# EAGLE design Crossover_LP (EAGLE 7.5.0)
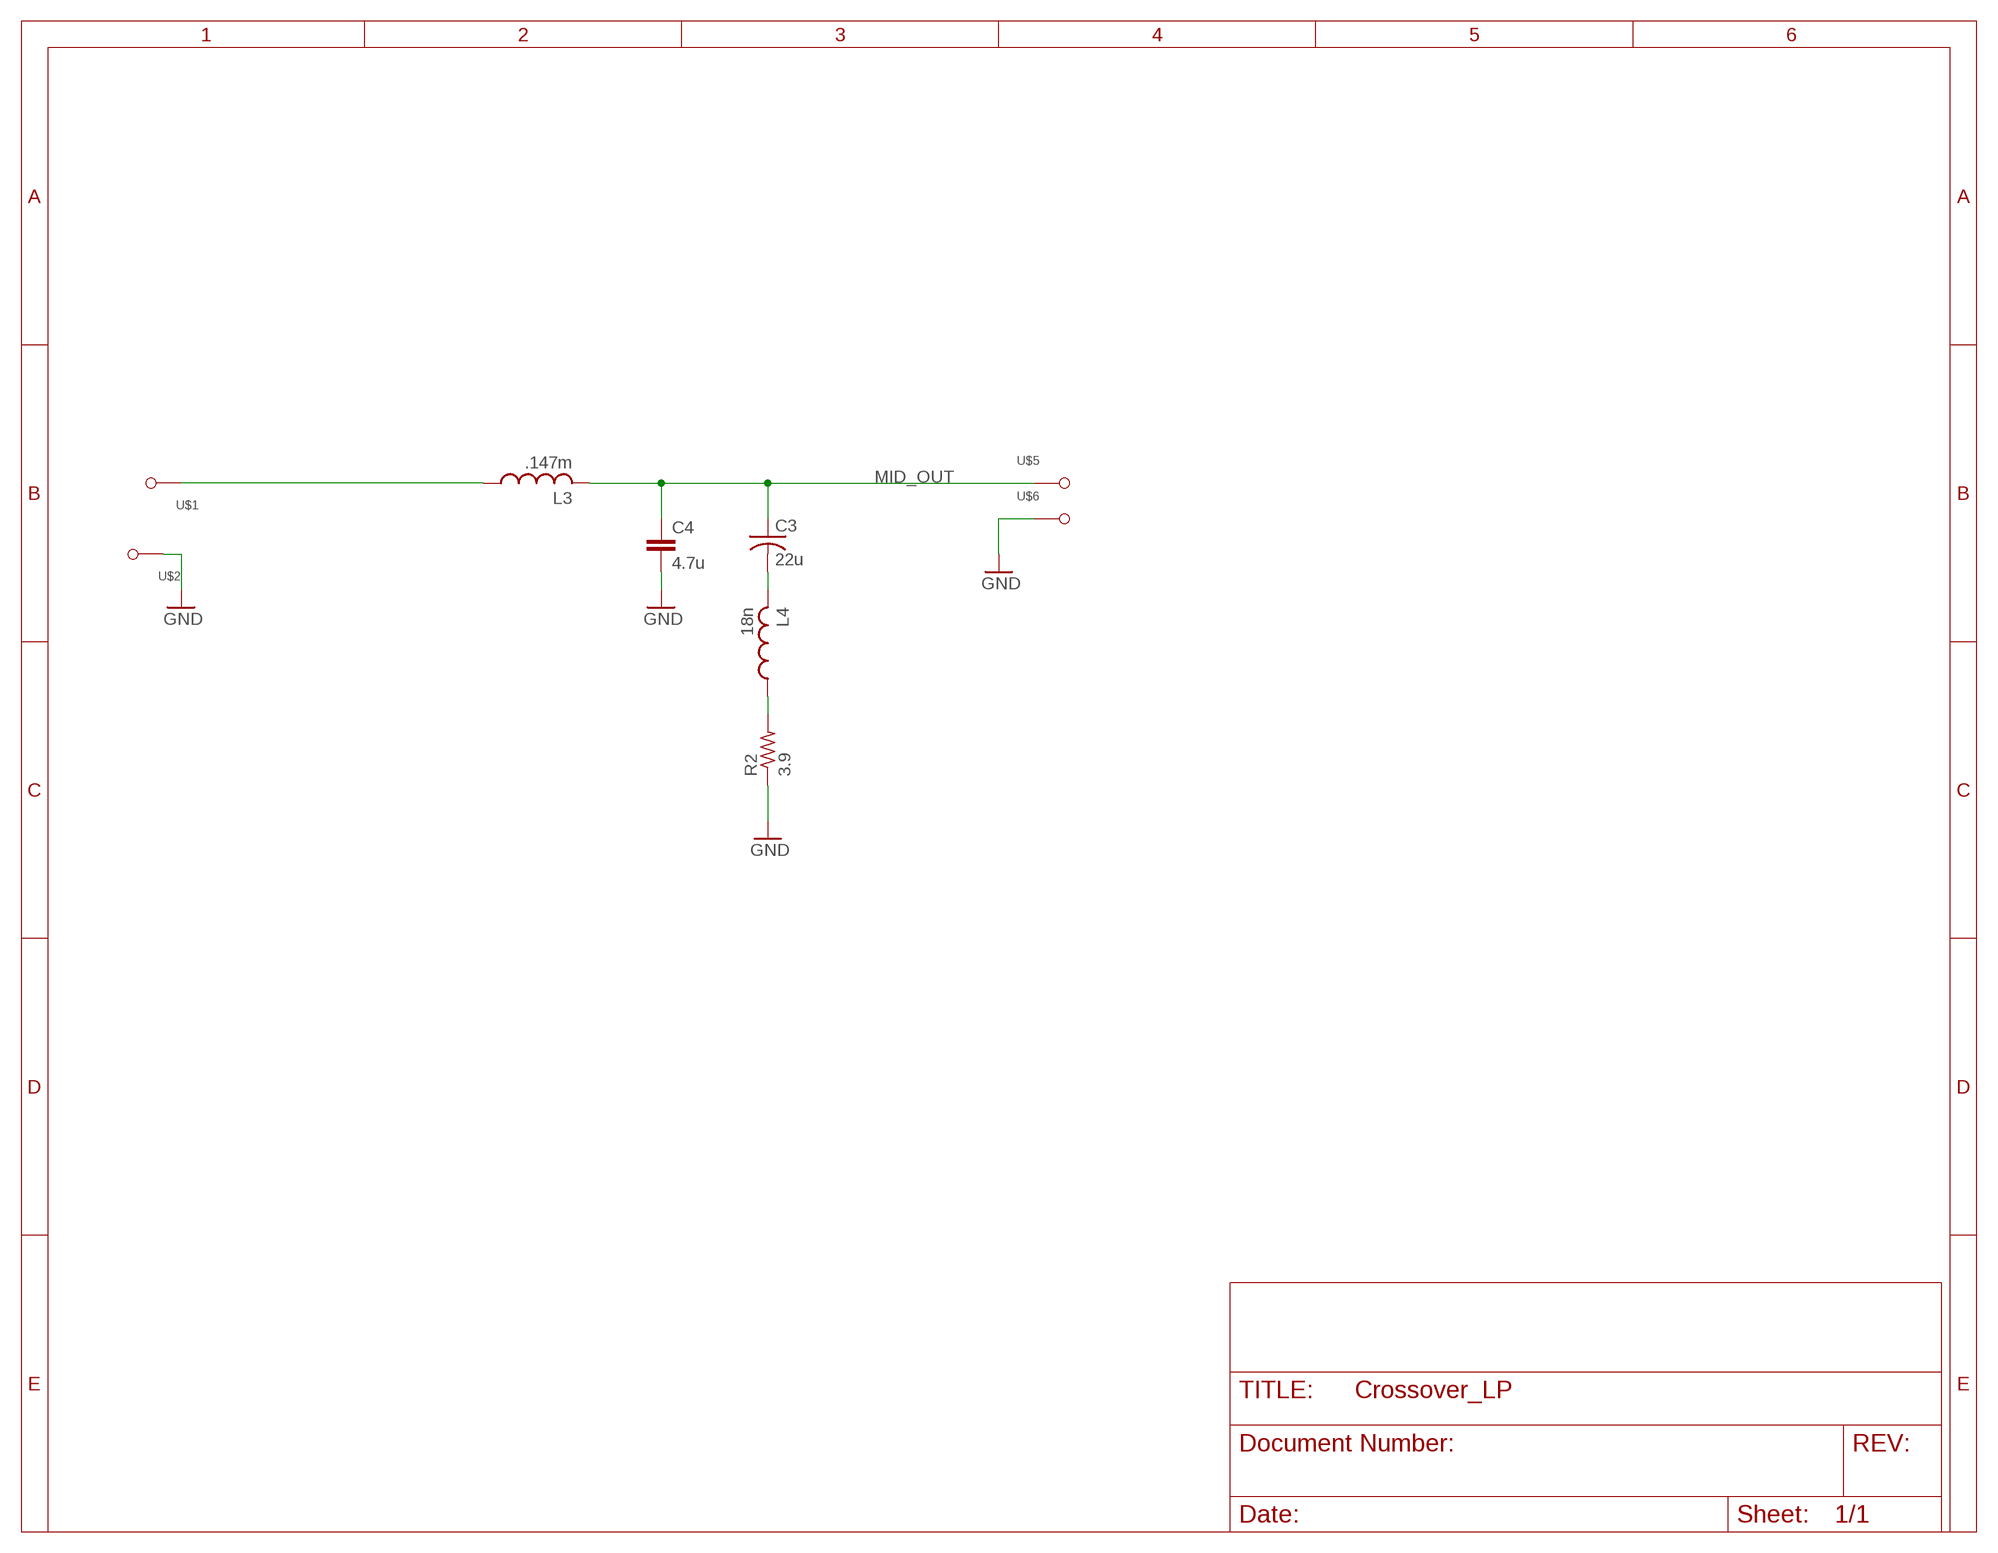
[diagram p0: schematic, sheet 1]

## Parts
C3  22u  C-USC5MMP_10MMD  [5MMP_10MMD]
C4  4.7u  C-EU225-074X268  [C225-074X268]
L3  .147m  L-US  [AIR_COIL_2INX3/4IN]
L4  18n  L-US  [AIR_COIL_2INX3/4IN]
R2  3.9  R-US_5W  [9.5MMX9MMX22MM]
U$1  18AWG_HOLE  [18AWG_HOLE]
U$2  18AWG_HOLE  [18AWG_HOLE]
U$5  18AWG_HOLE  [18AWG_HOLE]
U$6  18AWG_HOLE  [18AWG_HOLE]

## Nets
GND: C4.2 R2.P$1 U$2.P$1(>NAME) U$6.P$1(>NAME)
MID_OUT: C3.POS C4.1 L3.P$2 U$5.P$1(>NAME)
N$6: L3.P$1 U$1.P$1(>NAME)
N$8: C3.NEG L4.P$2
N$9: L4.P$1 R2.P$2

## Library data of the parts
C3 = rcl:C-US: CAPACITOR, American symbol
C4 = rcl:C-EU: CAPACITOR, European symbol
L3 L4 = rcl:L-US: INDUCTOR, American symbol
R2 = rcl:R-US_: RESISTOR, American symbol
U$1 U$2 U$5 U$6 = Amplifier_Parts:18AWG_HOLE

## Board
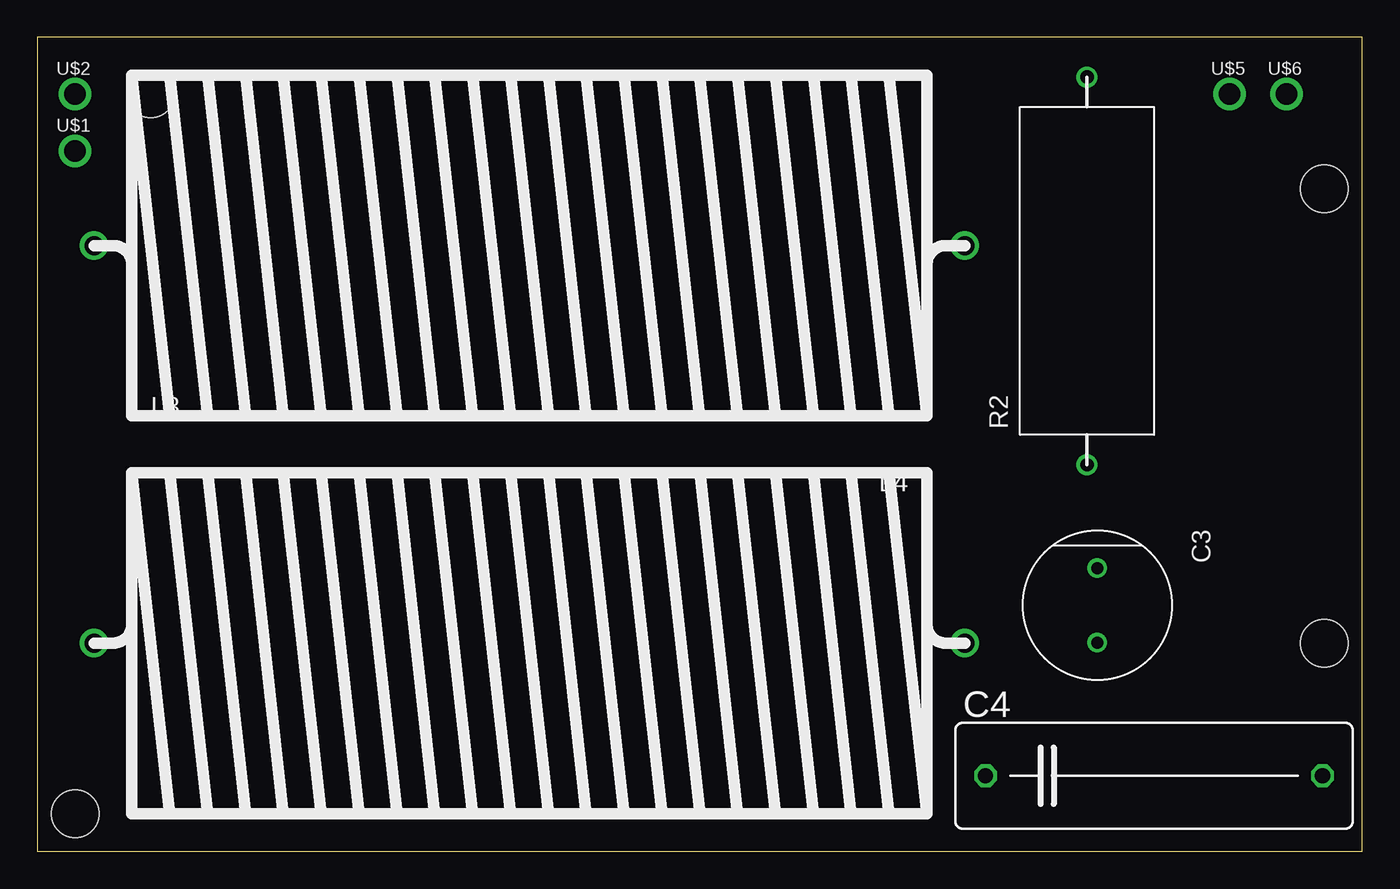
[diagram p1: board, top side]
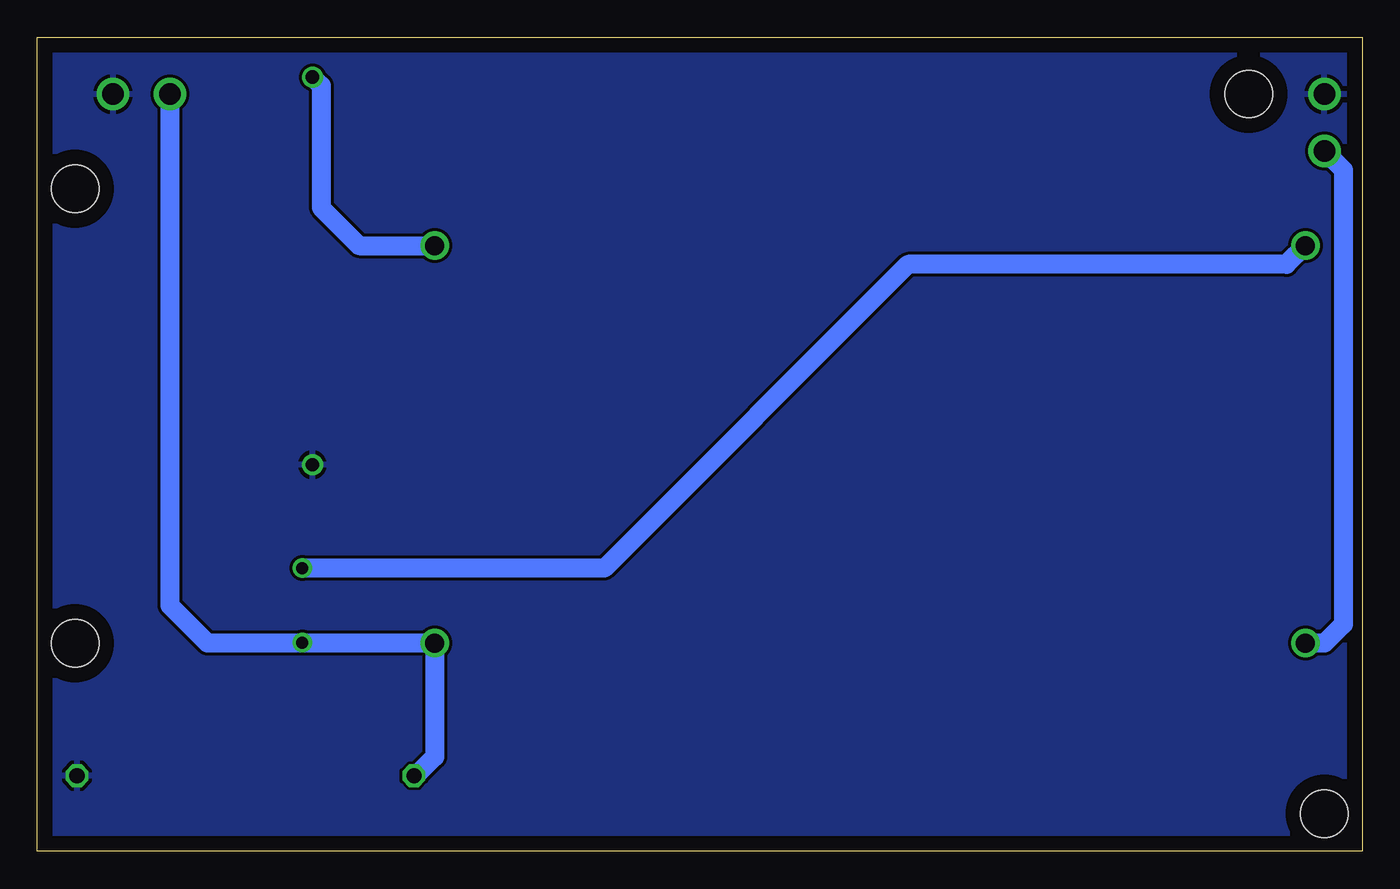
[diagram p2: board, bottom side, seen from below]

Size 88.9 x 54.61 mm. Coordinates in mm from the lower left corner, seen from the top.
Outline: 0,0 88.9,0 88.9,54.61 0,54.6 0,0
Copper layers (1*16): Top 0.035mm / dielectric 1.5mm / Bottom 0.035mm
Design rules "default": minimum track width 10mil, minimum drill 24mil, track to track 8mil, track to pad 8mil, pad to pad 8mil, via to via 8mil, smd to smd 8mil, copper to edge 40mil, drill to drill 8mil, minimum pad ring 10mil, minimum via ring 8mil, stop-mask expansion 4mil, vias tented up to drill 0mil, thermal gap 10mil
Holes 3.17 mm at 2.54,2.54 86.36,44.45 86.36,13.97 7.62,50.8

### Footprints (pad centres in the part's own frame; a part is rotated, then mirrored left to right if it is on the bottom)
5MMP_10MMD = drill 0.8: NEG -2.5,0; POS 2.5,0
C225-074X268 = drill 1.016 octagon: 1 -11.303,0; 2 11.303,0
AIR_COIL_2INX3/4IN = drill 1.27: P$1 -2.54,11.43; P$2 55.88,11.43
9.5MMX9MMX22MM = drill 0.9: P$1 -2,4.5; P$2 24,4.5
18AWG_HOLE = drill 1.448: P$1 0,0

### Placement (x,y rotation side)
C3  71.12,16.51 270 top
C4  74.93,5.08 0 top
L3  6.35,2.54 0 top
L4  59.69,52.07 180 top
R2  74.93,27.94 90 top
U$1  2.54,46.99 0 top
U$2  2.54,50.8 0 top
U$5  80.01,50.8 0 top
U$6  83.82,50.8 0 top

### Tracks (layer width: path | path; a pad name or v marks a point on that pad's centre or on a via)
GND
  pour Bottom: 0,0 90.17,0 90.17,49.53 90.17,55.88 0,55.88
MID_OUT
  Bottom 1.27: C4.1 63.5,5.08 62.23,6.35 L3.P$2 71.12,13.97 C3.POS 77.43,14.01 77.47,13.97 80.01,16.51 U$5.P$1
N$6
  Bottom 1.27: U$1.P$1 1.27,45.72 1.27,15.24 2.54,13.97 L3.P$1
N$8
  Bottom 1.27: L4.P$2 5.08,39.37 30.48,39.37 50.84,19.01 C3.NEG
N$9
  Bottom 1.27: R2.P$2 69.85,51.36 69.85,43.18 67.31,40.64 L4.P$1